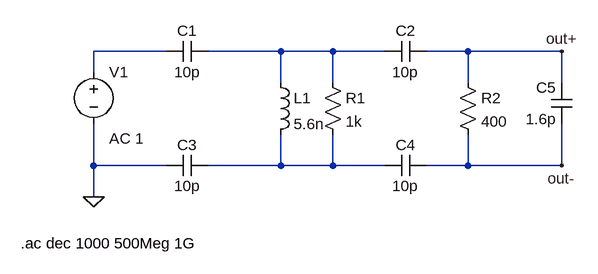
[diagram p0: schematic lt5537_matching.asc]
lt5537_matching.asc, the LTspice schematic file:
Version 4
SHEET 1 880 680
WIRE 0 224 -112 224
WIRE 176 224 64 224
WIRE 256 224 176 224
WIRE 336 224 256 224
WIRE 464 224 400 224
WIRE 608 224 464 224
WIRE -112 256 -112 224
WIRE 176 272 176 224
WIRE 256 272 256 224
WIRE 464 272 464 224
WIRE 608 272 608 224
WIRE -112 400 -112 336
WIRE 0 400 -112 400
WIRE 176 400 176 352
WIRE 176 400 64 400
WIRE 256 400 256 352
WIRE 256 400 176 400
WIRE 336 400 256 400
WIRE 464 400 464 352
WIRE 464 400 400 400
WIRE 608 400 608 336
WIRE 608 400 464 400
WIRE -112 448 -112 400
FLAG -112 448 0
FLAG 608 224 out+
FLAG 608 400 out-
SYMBOL voltage -112 240 R0
WINDOW 123 24 118 Left 2
SYMATTR InstName V1
SYMATTR Value ""
SYMATTR Value2 AC 1
SYMBOL cap 64 208 R90
WINDOW 0 0 32 VBottom 2
WINDOW 3 32 32 VTop 2
SYMATTR InstName C1
SYMATTR Value 10p
SYMBOL cap 400 208 R90
WINDOW 0 0 32 VBottom 2
WINDOW 3 32 32 VTop 2
SYMATTR InstName C2
SYMATTR Value 10p
SYMBOL res 240 256 R0
SYMATTR InstName R1
SYMATTR Value 1k
SYMBOL ind 160 256 R0
SYMATTR InstName L1
SYMATTR Value 5.6n
SYMBOL cap 64 384 R90
WINDOW 0 0 32 VBottom 2
WINDOW 3 32 32 VTop 2
SYMATTR InstName C3
SYMATTR Value 10p
SYMBOL cap 400 384 R90
WINDOW 0 0 32 VBottom 2
WINDOW 3 32 32 VTop 2
SYMATTR InstName C4
SYMATTR Value 10p
SYMBOL res 448 256 R0
SYMATTR InstName R2
SYMATTR Value 400
SYMBOL cap 624 336 R180
WINDOW 0 24 56 Left 2
WINDOW 3 24 8 Left 2
SYMATTR InstName C5
SYMATTR Value 1.6p
TEXT -224 520 Left 2 !.ac dec 1000 500Meg 1G

The netlist it stands for:
* lt5537_matching.asc
V1 N001 0 AC 1
C1 N002 N001 10p
C2 out+ N002 10p
R1 N002 N003 1k
L1 N002 N003 5.6n
C3 N003 0 10p
C4 out- N003 10p
R2 out+ out- 400
C5 out- out+ 1.6p
.ac dec 1000 500Meg 1G
.backanno
.end